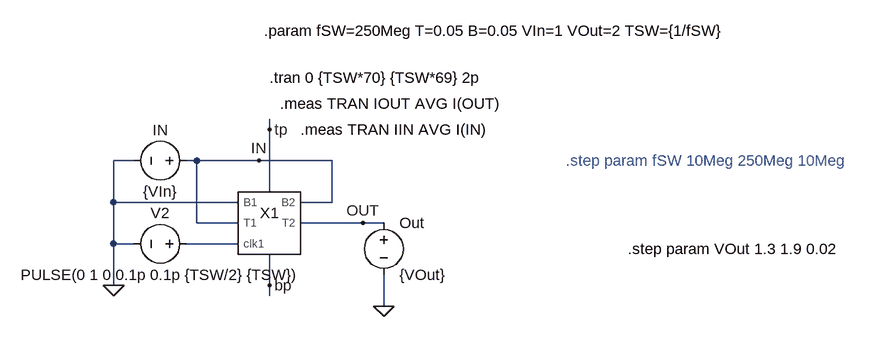
[diagram p0: schematic SCcore_TB.asc]
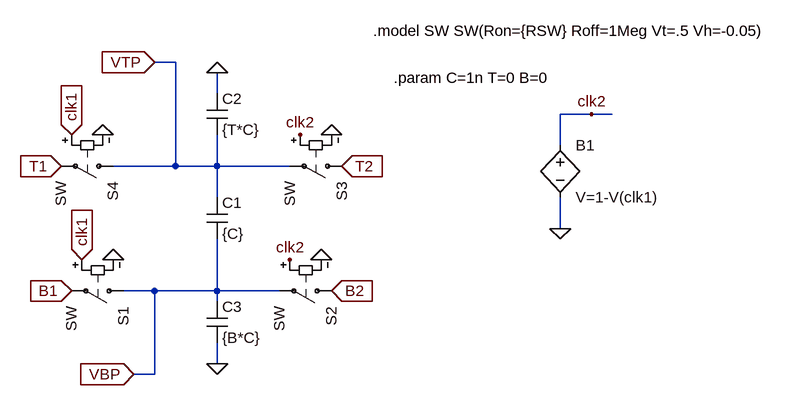
[diagram p1: sub-circuit sccore.asc]
SCcore_TB.asc, the LTspice schematic file:
Version 4
SHEET 1 1080 680
WIRE 160 0 160 -16
WIRE -48 48 -80 48
WIRE 48 48 32 48
WIRE 144 48 48 48
WIRE 256 48 144 48
WIRE 160 96 160 0
WIRE -80 112 -80 48
WIRE 112 112 -80 112
WIRE 256 112 256 48
WIRE 256 112 208 112
WIRE 48 144 48 48
WIRE 112 144 48 144
WIRE 304 144 208 144
WIRE 336 144 304 144
WIRE -80 176 -80 112
WIRE -48 176 -80 176
WIRE 112 176 32 176
WIRE -80 240 -80 176
WIRE 160 240 160 192
WIRE 160 256 160 240
WIRE 336 272 336 224
FLAG -80 240 0
FLAG 144 48 IN
FLAG 304 144 OUT
FLAG 336 272 0
FLAG 160 0 tp
FLAG 160 240 bp
SYMBOL SCcore 160 144 R0
SYMATTR InstName X1
SYMATTR SpiceLine T={T}, B={B}, RSW={1}, C={1n}
SYMBOL voltage 48 48 R90
WINDOW 0 -32 56 VBottom 2
WINDOW 3 32 56 VTop 2
SYMATTR InstName IN
SYMATTR Value {VIn}
SYMBOL voltage 48 176 R90
WINDOW 0 -32 56 VBottom 2
WINDOW 3 32 56 VTop 2
WINDOW 123 0 0 Left 0
WINDOW 39 0 0 Left 0
SYMATTR InstName V2
SYMATTR Value PULSE(0 1 0 0.1p 0.1p {TSW/2} {TSW})
SYMBOL voltage 336 128 R0
SYMATTR InstName Out
SYMATTR Value {VOut}
TEXT 152 -152 Left 2 !.param fSW=250Meg T=0.05 B=0.05 VIn=1 VOut=2 TSW={1/fSW}
TEXT 160 -80 Left 2 !.tran 0 {TSW*70} {TSW*69} 2p
TEXT 176 -40 Left 2 !.meas TRAN IOUT AVG I(OUT)
TEXT 616 48 Left 2 ;.step param fSW 10Meg 250Meg 10Meg
TEXT 208 0 Left 2 !.meas TRAN IIN AVG I(IN)
TEXT 712 184 Left 2 !.step param VOut 1.3 1.9 0.02

sccore.asc, the sub-circuit schematic file:
Version 4
SHEET 1 1152 680
WIRE 160 -128 128 -128
WIRE 224 -80 224 -112
WIRE 800 -48 752 -48
WIRE 832 -48 800 -48
WIRE 752 0 752 -48
WIRE 160 32 160 -128
WIRE 160 32 64 32
WIRE 224 32 224 -16
WIRE 224 32 160 32
WIRE 336 32 224 32
WIRE 224 80 224 32
WIRE 752 128 752 80
WIRE 128 224 80 224
WIRE 224 224 224 144
WIRE 224 224 128 224
WIRE 320 224 224 224
WIRE 224 240 224 224
WIRE 224 336 224 304
WIRE 128 352 128 224
WIRE 128 352 96 352
FLAG 224 336 0
FLAG 224 -112 0
FLAG 416 32 T2
IOPIN 416 32 In
FLAG -16 32 T1
IOPIN -16 32 In
FLAG 400 224 B2
IOPIN 400 224 In
FLAG 0 224 B1
IOPIN 0 224 In
FLAG 0 -16 clk1
IOPIN 0 -16 In
FLAG 16 176 clk1
IOPIN 16 176 In
FLAG 352 -16 clk2
FLAG 48 -16 0
FLAG 400 -16 0
FLAG 384 176 0
FLAG 64 176 0
FLAG 752 128 0
FLAG 800 -48 clk2
FLAG 336 176 clk2
FLAG 128 -128 VTP
IOPIN 128 -128 In
FLAG 96 352 VBP
IOPIN 96 352 In
SYMBOL cap 208 80 R0
SYMATTR InstName C1
SYMATTR Value {C}
SYMBOL cap 208 -80 R0
SYMATTR InstName C2
SYMATTR Value {T*C}
SYMBOL cap 208 240 R0
SYMATTR InstName C3
SYMATTR Value {B*C}
SYMBOL sw 96 224 R90
SYMATTR InstName S1
SYMBOL sw 416 224 R90
SYMATTR InstName S2
SYMBOL sw 432 32 R90
SYMATTR InstName S3
SYMBOL sw 80 32 R90
SYMATTR InstName S4
SYMBOL bv 752 -16 R0
SYMATTR InstName B1
SYMATTR Value V=1-V(clk1)
TEXT 464 -176 Left 2 !.model SW SW(Ron={RSW} Roff=1Meg Vt=.5 Vh=-0.05)
TEXT 496 -104 Left 2 !.param C=1n T=0 B=0

The netlist it stands for:
* SCcore_TB.asc
XX1 0 IN N001 IN OUT tp bp sccore params: T={T}, B={B}, RSW={1}, C={1n}
V§IN IN 0 {VIn}
V2 N001 0 PULSE(0 1 0 0.1p 0.1p {TSW/2} {TSW})
V§Out OUT 0 {VOut}

* block symbol definitions
.subckt sccore B1 B2 clk1 T1 T2 VTP VBP
C1 VTP VBP {C}
C2 0 VTP {T*C}
C3 VBP 0 {B*C}
S1 VBP B1 clk1 0 SW
S2 B2 VBP clk2 0 SW
S3 T2 VTP clk2 0 SW
S4 VTP T1 clk1 0 SW
B1 clk2 0 V=1-V(clk1)
.model SW SW(Ron={RSW} Roff=1Meg Vt=.5 Vh=-0.05)
.param C=1n T=0 B=0
.ends sccore

.param fSW=250Meg T=0.05 B=0.05 VIn=1 VOut=2 TSW={1/fSW}
.tran 0 {TSW*70} {TSW*69} 2p
.meas TRAN IOUT AVG I(OUT)
* .step param fSW 10Meg 250Meg 10Meg
.meas TRAN IIN AVG I(IN)
.step param VOut 1.3 1.9 0.02
.backanno
.end